# Altium project jlink_adapter_v0.PrjPcb
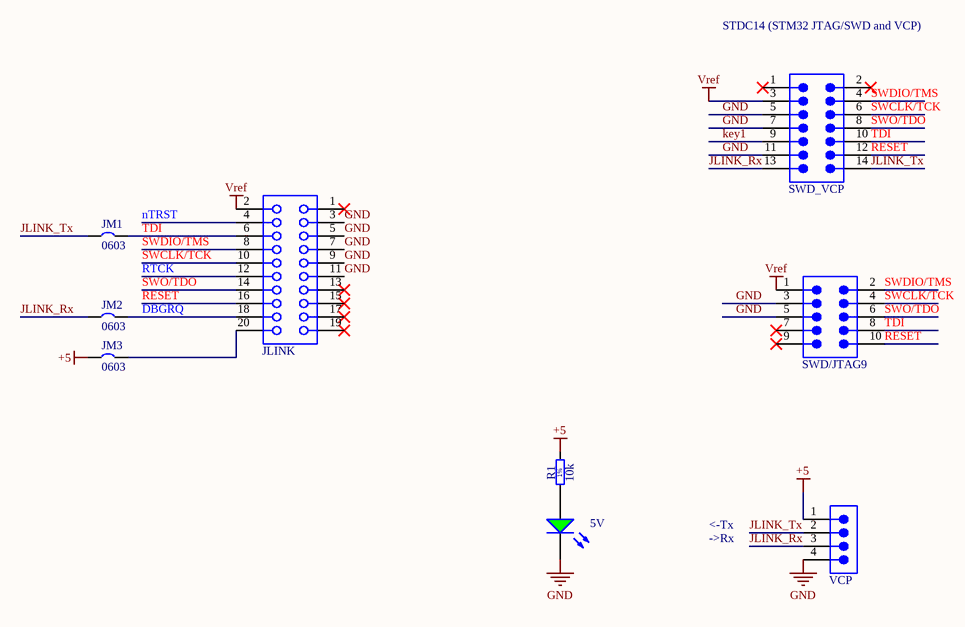
[diagram p0: jlink_adapter_v0.SchDoc]
1 sheet, 9 parts. Net scope: global (net labels, ports and power ports of the same name join across sheets).

## Sheet jlink_adapter_v0.SchDoc
size A4

### Parts
5V  (no value)  [LED0603]
JLINK  613020243121  [613020243121]  (value not drawn)
JM1  PackageReference: 0603  [NT0603_10]  (net tie, no BOM)
JM2  PackageReference: 0603  [NT0603_10]  (net tie, no BOM)
JM3  PackageReference: 0603  [NT0603_10]  (net tie, no BOM)
R1  10k  [RESC1608X55N]
SWD/JTAG9  62701020621  [62701020621]  (value not drawn)
SWD_VCP  62731420621  [62731420621]  (value not drawn)
VCP  61300411121  [61300411121]  (value not drawn)

### Nets
+5: JM3.1 R1.2 VCP.1
GND: 5V.1(K) JLINK.3 JLINK.5 JLINK.7 JLINK.9 JLINK.11 SWD/JTAG9.3 SWD/JTAG9.5 SWD_VCP.5 SWD_VCP.7 SWD_VCP.11 VCP.4
Vref: JLINK.2 SWD/JTAG9.1 SWD_VCP.3
DBGRQ: JLINK.18 JM2.2
JLINK_Rx: JM2.1 SWD_VCP.13 VCP.3
JLINK_Tx: JM1.1 SWD_VCP.14 VCP.2
key1: SWD_VCP.9
nTRST: JLINK.4
RESET: JLINK.16 SWD/JTAG9.10 SWD_VCP.12
RTCK: JLINK.12
SWCLK/TCK: JLINK.10 SWD/JTAG9.4 SWD_VCP.6
SWDIO/TMS: JLINK.8 SWD/JTAG9.2 SWD_VCP.4
SWO/TDO: JLINK.14 SWD/JTAG9.6 SWD_VCP.8
TDI: JLINK.6 JM1.2 SWD/JTAG9.8 SWD_VCP.10
Net5V_2: 5V.2(A) R1.1
NetJLINK_20: JLINK.20 JM3.2

Not connected (* = marked no-connect by the designer): JLINK 1* 13* 15* 17* 19*; SWD/JTAG9 7* 9*; SWD_VCP 1* 2*

### Notes on the sheet
- STDC14 (STM32 JTAG/SWD and VCP)
- ->Rx
- <-Tx
- (in symbol R0603_10k_1%_0.1W_100ppm_VISHAY_CRCW060310K0FKEA) 1%

### Library data of the parts
5V = LED_G_0603: LED green 0603; Opis: LED, zieona, SMD; PackageReference: 0603; Drawn by: P. Kawula
JLINK = 613020243121: WR-PHD Socket Header, THT, Angled, pitch 2.54mm, 2 Row, 20P; Manufacturer: Wurth Elektronik; Contact Resistance: 20mΩ; Rated Current: 3A; Working Voltage: 250V; Withstanding Voltage: 500V; ComponentLink1Description: Website Link; ComponentLink1URL: https://www.we-online.com/redexpert/article/613020243121?ad; ComponentLink2Description: Datasheet Link; ComponentLink2URL: https://www.we-online.com/redexpert/spec/613020243121?ad; Manufacturer Part Number: 613020243121; Category: Board-to-Board Connectors; Match Code: WR-PHD; Mount: Through Hole; Operating Temperature Max: 125°C; Operating Temperature Min: -40°C; Packaging: Tray; Gender: Socket Header; Number of Pins: 20; Number of Rows: 2; Orientation: Angled; Pitch: 2.54mm
JM1-JM3 = JM_0603: Jumper; Tolerance: 5%; Opis: Zwora; Temperature: -55..+150; Drawn by: P. Kawula; Checked by: *; Manufacturer: *; Current: *
R1 = R0603_10k_1%_0.1W_100ppm_VISHAY_CRCW060310K0FKEA: Resistor - 1%; Part Description: General Purpose Thick Film Chip Resistor; Manufacturer: VISHAY; Power: 0.1W; TC: 100ppm; Voltage: 75V; Part Number: R0603_10k_1%_0.1W_100ppm_VISHAY_CRCW060310K0FKEA; Component Kind: Standard; Component Type: Standard; Pin Count: 2; Value: 10k; Status: Preferred; Tolerance: ± 1%; Manufacturer Part Number: CRCW060310K0FKEA; Mounted: Yes; Socket: No; SMD: Yes; Manufacturer1 Example: VISHAY; Manufacturer1 Part Number: CRCW060310K0FKEA; HelpURL: http://www.farnell.com/datasheets/2111201.pdf?_ga=1.259713484.714163394.1473712482; Author: P. Kawula; CreateDate: 2017-02-10; LatestRevisionDate: 2017-02-10; Supplier 1: Farnell; Supplier Part Number 1: 1469748; Supplier Part Number 3: 0603
SWD/JTAG9 = 62701020621: WR-BHD Male Box Header, SMT Straight, pitch 1.27mm, 2 Row, 10 pin; Manufacturer: Wurth Elektronik; Contact Resistance: 20mOhm; Insulation Resistance: 1000MOhm; Rated Current: 1A; Working Voltage: 50V; Withstanding Voltage: 500V; Manufacturer Part Number: 62701020621; Category: Wire-to-Board Connectors; Match Code: WR-BHD; ComponentLink1Description: Website Link; ComponentLink1URL: https://www.we-online.com/redexpert/article/62701020621?ad; ComponentLink2Description: Datasheet Link; ComponentLink2URL: https://www.we-online.com/redexpert/spec/62701020621?ad; Mount: Surface Mount; Operating Temperature Max: 105°C; Operating Temperature Min: -40°C; Packaging: Tape and Reel; Length: 12.7mm; Width: 5mm; Height: 5.3mm; Gender: Male; Number of Pins: 10; Number of Rows: 2; Orientation: Straight; Pitch: 1.27mm
SWD_VCP = 62731420621: WR-BHD Male Box Header, SMT Straight, pitch 1.27mm, 2 Row, 14 pin; Manufacturer: Wurth Elektronik; Contact Resistance: 20mOhm; Insulation Resistance: 1000MOhm; Rated Current: 1A; Working Voltage: 50V; Withstanding Voltage: 500V; Manufacturer Part Number: 62731420621; Category: Wire-to-Board Connectors; Match Code: WR-BHD; ComponentLink1Description: Website Link; ComponentLink1URL: https://www.we-online.com/redexpert/article/62731420621?ad; ComponentLink2Description: Datasheet Link; ComponentLink2URL: https://www.we-online.com/redexpert/spec/62731420621?ad; Mount: Surface Mount; Operating Temperature Max: 105°C; Operating Temperature Min: -40°C; Packaging: Tape and Reel; Length: 15.24mm; Width: 5mm; Height: 5.3mm; Gender: Male; Number of Pins: 14; Number of Rows: 2; Orientation: Straight; Pitch: 1.27mm
VCP = 61300411121: WR-PHD Pin Header, THT, Vertical, pitch 2.54mm, 1 Row, 4P; Manufacturer: Wurth Elektronik; Contact Resistance: 20mΩ; Rated Current: 3A; Working Voltage: 250V; Withstanding Voltage: 500V; ComponentLink1Description: Website Link; ComponentLink1URL: https://www.we-online.com/redexpert/article/61300411121?ad; ComponentLink2Description: Datasheet Link; ComponentLink2URL: https://www.we-online.com/redexpert/spec/61300411121?ad; Manufacturer Part Number: 61300411121; Category: Board-to-Board Connectors; Match Code: WR-PHD; Mount: Through Hole; Operating Temperature Max: 105°C; Operating Temperature Min: -40°C; Packaging: Bag; Gender: Pin Header; Number of Pins: 4; Number of Rows: 1; Orientation: Vertical; Pitch: 2.54mm